# Altium schematic sheet Mynd_Batt.SchDoc: Mynd-Batt-Conn
size A3; ApprovedBy: Jianhua.Zhong; CheckedBy: Aileen.zheng; DrawnBy: GUOHUI.LIN; Revision: 3.1; SheetNumber: 1; SheetTotal: 1; Model NO.: PS23007; ISSUE DATE: 20230810; REV DATE: 20231025; ImagePath: 1
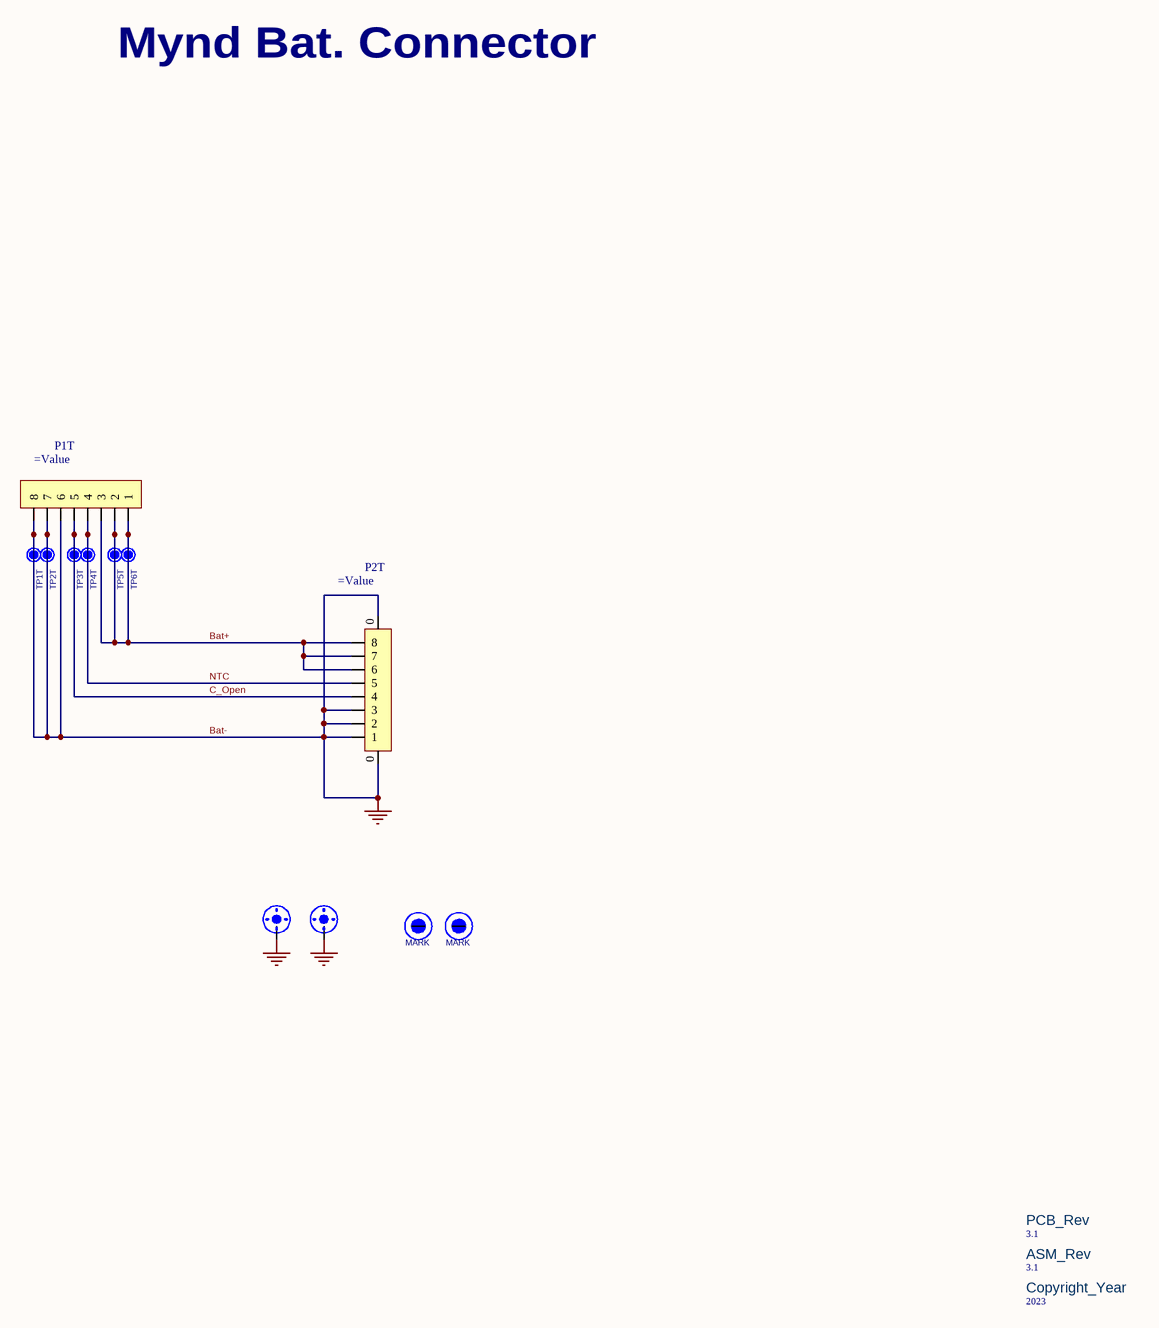
[diagram p0: Mynd_Batt.SchDoc]

## Parts
MH1T  SCREW_HOLE  [SCREW_D32]  (value not drawn)  (no BOM)
MH2T  SCREW_HOLE  [SCREW_D32]  (value not drawn)  (no BOM)
MK1T  MARK  [MARK]  (no BOM)
MK2T  MARK  [MARK]  (no BOM)
P1T  (no value)  [TSB1_05282]
P2T  (no value)  [CON_250_SMD_H_8P]
Teufel_ASM_Label1T  3.1  [Teufel_ASM_Rev]  (no BOM)
Teufel_Copyright1T  2023  [TEUFEL_COPYRIGHT]  (no BOM)
Teufel_PCB_Label1T  3.1  [Teufel_PCB_Rev]  (no BOM)
Teufel_PCB_Logo1T  (no value)  [Teufel_NoLogo]  (no BOM)
TP1T  TP12  [TP120]  (value not drawn)  (no BOM)
TP2T  TP12  [TP120]  (value not drawn)  (no BOM)
TP3T  TP12  [TP120]  (value not drawn)  (no BOM)
TP4T  TP12  [TP120]  (value not drawn)  (no BOM)
TP5T  TP12  [TP120]  (value not drawn)  (no BOM)
TP6T  TP12  [TP120]  (value not drawn)  (no BOM)

## Nets
Bat-: MH1T.1 MH2T.1 P1T.6 P1T.7 P1T.8 P2T.0 P2T.1 P2T.2 P2T.3 TP1T.1 TP2T.1  [also labelled GND]
Bat+: P1T.1 P1T.2 P1T.3 P2T.6 P2T.7 P2T.8 TP5T.1 TP6T.1
C_Open: P1T.5 P2T.4 TP3T.1
NTC: P1T.4 P2T.5 TP4T.1

Not connected (* = marked no-connect by the designer): MK1T MK_B MK_T; MK2T MK_B MK_T

## Notes on the sheet
- Mynd Bat. Connector
- Revision:
- Lautspreecher Teufel GmbH
- Budapester Straße 44
- 10787 Berlin
- Germany
- Page Title:
- Engineer:
- Project:
- Version:
- Rev:
- modified:
- Date:
- Size:
- A3
- File Name:
- Page:
- of
- (in symbol CMP-00086-3) Copyright_Year
- (in symbol CMP-00087-3) PCB_Rev
- (in symbol CMP-00088-3) ASM_Rev

## Library data of the parts
MH1T MH2T = N-001-00005-4: SCREW_HOLE D3.2mm; Design Item ID: SCREW_HOLE
MK1T MK2T = N-001-00003-2: MARK DOT; Design Item ID: MARK
P1T = C-001-0506-10: SMD BTB CONNECTOR 8P P2.5mm GOLD; Manufacturer: Multi-Sourced; Part_Number: 8P PITCH=2.5mm; Part_Type: Connector 8 Pin SMT; Value: 8P PITCH=2.5mm; System: Connector
P2T = C-001-1108-2: SMD WTB CONNECTOR 8P P2.5mm TIN; Manufacturer: Multi-Sourced; Part_Number: WT250MW-084R-0W; Part_Type: Connector WTB SMT; Value: WT250MW-084R-0W; System: Connector
Teufel_ASM_Label1T = CMP-00088-3: Teufel_ASM_Rev; Value: 3.1
Teufel_Copyright1T = CMP-00086-3: Teufel_Copyright_Year; Value: 2023
Teufel_PCB_Label1T = CMP-00087-3: Teufel_PCB_Label; Value: 3.1
Teufel_PCB_Logo1T = Teufel NoLogo: Teufel PCB NoLogo
TP1T TP2T TP3T TP4T TP5T TP6T = N-001-00010-2: Test Point; Design Item ID: TP